# EAGLE schematic base (EAGLE 6.1)
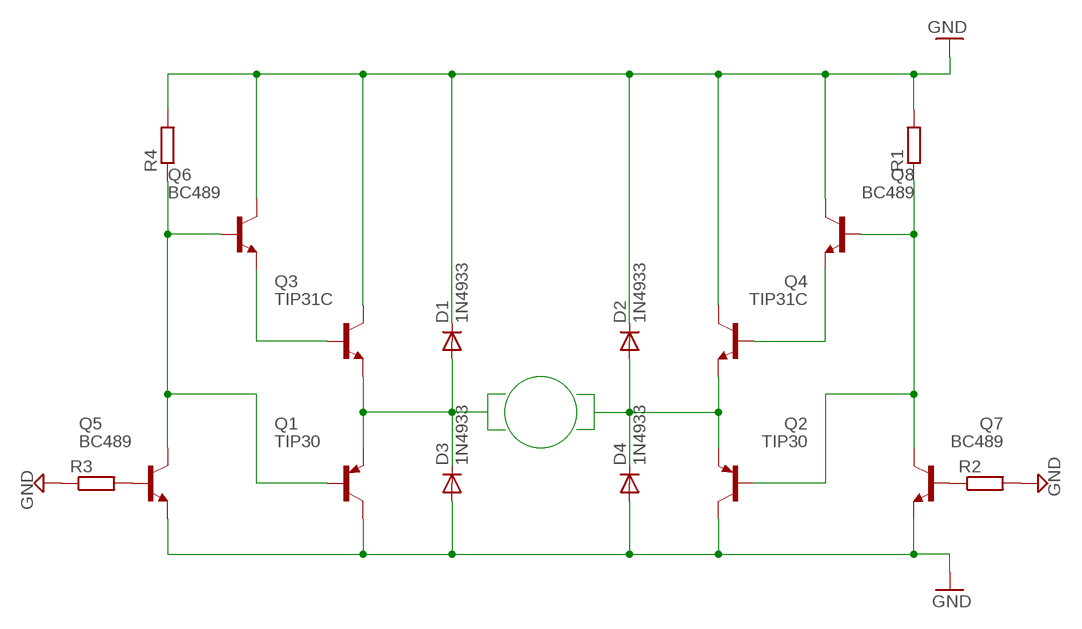
[diagram p0: schematic, sheet 1]

## Parts
D1  1N4933  [DO41-10]
D2  1N4933  [DO41-10]
D3  1N4933  [DO41-10]
D4  1N4933  [DO41-10]
Q1  TIP30  [TO220]
Q2  TIP30  [TO220]
Q3  TIP31C  [TO220]
Q4  TIP31C  [TO220]
Q5  BC489  [TO92-EBC]
Q6  BC489  [TO92-EBC]
Q7  BC489  [TO92-EBC]
Q8  BC489  [TO92-EBC]
R1  R-EU_0204/7  [0204/7]
R2  R-EU_0204/7  [0204/7]
R3  R-EU_0204/7  [0204/7]
R4  R-EU_0204/7  [0204/7]

## Nets
GND: D1.C D2.C D3.A D4.A Q1.2(C) Q2.2(C) Q3.2(C) Q4.2(C) Q5.E Q6.C Q7.E Q8.C R1.2 R2.2 R3.1 R4.2
N$1: Q3.1(B) Q6.E
N$4: Q4.1(B) Q8.E
N$5: Q5.B R3.2
N$6: Q7.B R2.1
N$7: D1.A D3.C Q1.3(E) Q3.3(E)
N$8: D2.A D4.C Q2.3(E) Q4.3(E)
N$9: Q2.1(B) Q7.C Q8.B R1.1
N$13: Q1.1(B) Q5.C Q6.B R4.1

## Library data of the parts
D1-D4 = diode:1N4933: DIODE fast recovery rectifier, 1A
Q1 Q2 = transistor-pnp:TIP30: PNP Transistor
Q3 Q4 = transistor-npn:TIP31C*: NPN Transistor
Q5-Q8 = transistor-npn:BC489*: NPN Transistor
R1-R4 = resistor:R-EU_: RESISTOR, European symbol